# Altium schematic sheet Fri3D_2018_LEDS_00.SchDoc: Fri3D Badge 2018
size A3; Date: 22/05/2017; DrawnBy: Wim Van Gool; DocumentNumber: 3; Revision: 00; SheetNumber: 3; SheetTotal: 4
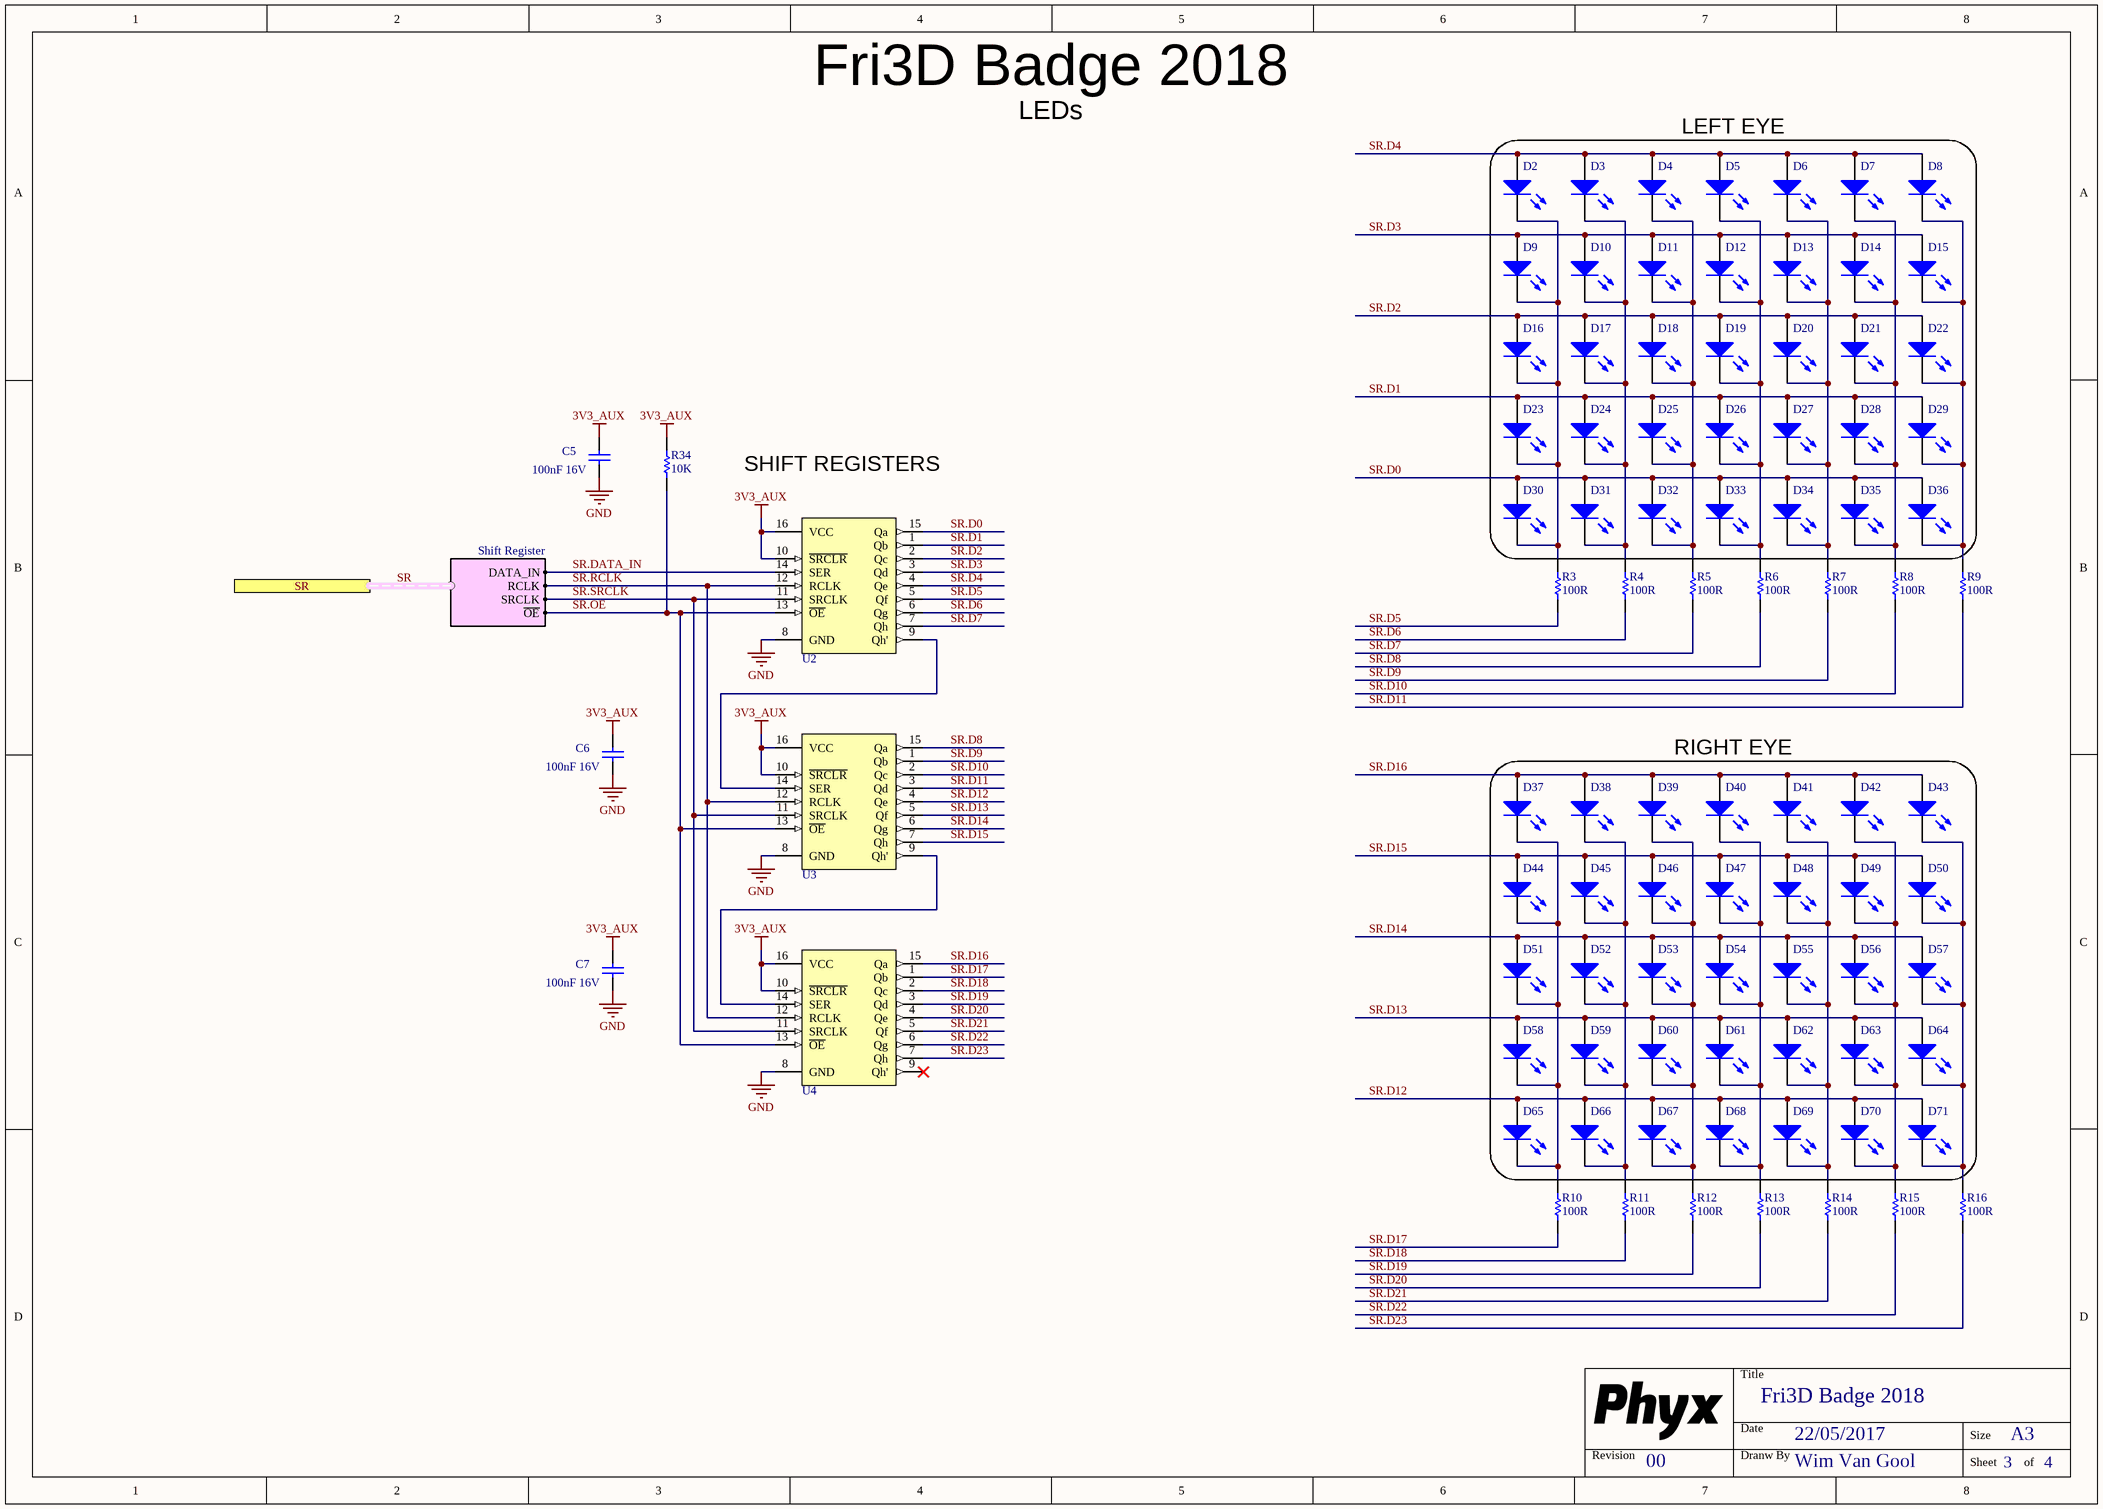
[diagram p0: Fri3D_2018_LEDS_00.SchDoc]

## Parts
C5  value 100nF 16V  [C0603_N]
C6  value 100nF 16V  [C0603_N]
C7  value 100nF 16V  [C0603_N]
D2  Default 0805 Blue LED  [LED_0805_BL]  (value not drawn)
D3  Default 0805 Blue LED  [LED_0805_BL]  (value not drawn)
D4  Default 0805 Blue LED  [LED_0805_BL]  (value not drawn)
D5  Default 0805 Blue LED  [LED_0805_BL]  (value not drawn)
D6  Default 0805 Blue LED  [LED_0805_BL]  (value not drawn)
D7  Default 0805 Blue LED  [LED_0805_BL]  (value not drawn)
D8  Default 0805 Blue LED  [LED_0805_BL]  (value not drawn)
D9  Default 0805 Blue LED  [LED_0805_BL]  (value not drawn)
D10  Default 0805 Blue LED  [LED_0805_BL]  (value not drawn)
D11  Default 0805 Blue LED  [LED_0805_BL]  (value not drawn)
D12  Default 0805 Blue LED  [LED_0805_BL]  (value not drawn)
D13  Default 0805 Blue LED  [LED_0805_BL]  (value not drawn)
D14  Default 0805 Blue LED  [LED_0805_BL]  (value not drawn)
D15  Default 0805 Blue LED  [LED_0805_BL]  (value not drawn)
D16  Default 0805 Blue LED  [LED_0805_BL]  (value not drawn)
D17  Default 0805 Blue LED  [LED_0805_BL]  (value not drawn)
D18  Default 0805 Blue LED  [LED_0805_BL]  (value not drawn)
D19  Default 0805 Blue LED  [LED_0805_BL]  (value not drawn)
D20  Default 0805 Blue LED  [LED_0805_BL]  (value not drawn)
D21  Default 0805 Blue LED  [LED_0805_BL]  (value not drawn)
D22  Default 0805 Blue LED  [LED_0805_BL]  (value not drawn)
D23  Default 0805 Blue LED  [LED_0805_BL]  (value not drawn)
D24  Default 0805 Blue LED  [LED_0805_BL]  (value not drawn)
D25  Default 0805 Blue LED  [LED_0805_BL]  (value not drawn)
D26  Default 0805 Blue LED  [LED_0805_BL]  (value not drawn)
D27  Default 0805 Blue LED  [LED_0805_BL]  (value not drawn)
D28  Default 0805 Blue LED  [LED_0805_BL]  (value not drawn)
D29  Default 0805 Blue LED  [LED_0805_BL]  (value not drawn)
D30  Default 0805 Blue LED  [LED_0805_BL]  (value not drawn)
D31  Default 0805 Blue LED  [LED_0805_BL]  (value not drawn)
D32  Default 0805 Blue LED  [LED_0805_BL]  (value not drawn)
D33  Default 0805 Blue LED  [LED_0805_BL]  (value not drawn)
D34  Default 0805 Blue LED  [LED_0805_BL]  (value not drawn)
D35  Default 0805 Blue LED  [LED_0805_BL]  (value not drawn)
D36  Default 0805 Blue LED  [LED_0805_BL]  (value not drawn)
D37  Default 0805 Blue LED  [LED_0805_BL]  (value not drawn)
D38  Default 0805 Blue LED  [LED_0805_BL]  (value not drawn)
D39  Default 0805 Blue LED  [LED_0805_BL]  (value not drawn)
D40  Default 0805 Blue LED  [LED_0805_BL]  (value not drawn)
D41  Default 0805 Blue LED  [LED_0805_BL]  (value not drawn)
D42  Default 0805 Blue LED  [LED_0805_BL]  (value not drawn)
D43  Default 0805 Blue LED  [LED_0805_BL]  (value not drawn)
D44  Default 0805 Blue LED  [LED_0805_BL]  (value not drawn)
D45  Default 0805 Blue LED  [LED_0805_BL]  (value not drawn)
D46  Default 0805 Blue LED  [LED_0805_BL]  (value not drawn)
D47  Default 0805 Blue LED  [LED_0805_BL]  (value not drawn)
D48  Default 0805 Blue LED  [LED_0805_BL]  (value not drawn)
D49  Default 0805 Blue LED  [LED_0805_BL]  (value not drawn)
D50  Default 0805 Blue LED  [LED_0805_BL]  (value not drawn)
D51  Default 0805 Blue LED  [LED_0805_BL]  (value not drawn)
D52  Default 0805 Blue LED  [LED_0805_BL]  (value not drawn)
D53  Default 0805 Blue LED  [LED_0805_BL]  (value not drawn)
D54  Default 0805 Blue LED  [LED_0805_BL]  (value not drawn)
D55  Default 0805 Blue LED  [LED_0805_BL]  (value not drawn)
D56  Default 0805 Blue LED  [LED_0805_BL]  (value not drawn)
D57  Default 0805 Blue LED  [LED_0805_BL]  (value not drawn)
D58  Default 0805 Blue LED  [LED_0805_BL]  (value not drawn)
D59  Default 0805 Blue LED  [LED_0805_BL]  (value not drawn)
D60  Default 0805 Blue LED  [LED_0805_BL]  (value not drawn)
D61  Default 0805 Blue LED  [LED_0805_BL]  (value not drawn)
D62  Default 0805 Blue LED  [LED_0805_BL]  (value not drawn)
D63  Default 0805 Blue LED  [LED_0805_BL]  (value not drawn)
D64  Default 0805 Blue LED  [LED_0805_BL]  (value not drawn)
D65  Default 0805 Blue LED  [LED_0805_BL]  (value not drawn)
D66  Default 0805 Blue LED  [LED_0805_BL]  (value not drawn)
D67  Default 0805 Blue LED  [LED_0805_BL]  (value not drawn)
D68  Default 0805 Blue LED  [LED_0805_BL]  (value not drawn)
D69  Default 0805 Blue LED  [LED_0805_BL]  (value not drawn)
D70  Default 0805 Blue LED  [LED_0805_BL]  (value not drawn)
D71  Default 0805 Blue LED  [LED_0805_BL]  (value not drawn)
R3  value 100R  [R0603_N]  (hidden comment: RESISTOR)
R4  value 100R  [R0603_N]  (hidden comment: RESISTOR)
R5  value 100R  [R0603_N]  (hidden comment: RESISTOR)
R6  value 100R  [R0603_N]  (hidden comment: RESISTOR)
R7  value 100R  [R0603_N]  (hidden comment: RESISTOR)
R8  value 100R  [R0603_N]  (hidden comment: RESISTOR)
R9  value 100R  [R0603_N]  (hidden comment: RESISTOR)
R10  value 100R  [R0603_N]  (hidden comment: RESISTOR)
R11  value 100R  [R0603_N]  (hidden comment: RESISTOR)
R12  value 100R  [R0603_N]  (hidden comment: RESISTOR)
R13  value 100R  [R0603_N]  (hidden comment: RESISTOR)
R14  value 100R  [R0603_N]  (hidden comment: RESISTOR)
R15  value 100R  [R0603_N]  (hidden comment: RESISTOR)
R16  value 100R  [R0603_N]  (hidden comment: RESISTOR)
R34  value 10K  [R0603_N]  (hidden comment: RESISTOR)
U2  8-Bit Shift Registers With 3-State Output Registers  [SOIC_N_16]  (value not drawn)
U3  8-Bit Shift Registers With 3-State Output Registers  [SOIC_N_16]  (value not drawn)
U4  8-Bit Shift Registers With 3-State Output Registers  [SOIC_N_16]  (value not drawn)

## Blocks framed on the sheet
LEFT EYE: D2-D36
RIGHT EYE: D37-D71

## Ports
SR (harness Shift Register)

## Harnesses
Shift Register: DATA_IN, RCLK, SRCLK, ~{OE}

## Nets
3V3_AUX: C5.1 C6.1 C7.1 R34.1 U2.10(~{SRCLR}) U2.16(VCC) U3.10(~{SRCLR}) U3.16(VCC) U4.10(~{SRCLR}) U4.16(VCC)
GND: C5.2 C6.2 C7.2 U2.8(GND) U3.8(GND) U4.8(GND)
SR.D0: D30.1(A) D31.1(A) D32.1(A) D33.1(A) D34.1(A) D35.1(A) D36.1(A) U2.15(Qa)
SR.D1: D23.1(A) D24.1(A) D25.1(A) D26.1(A) D27.1(A) D28.1(A) D29.1(A) U2.1(Qb)
SR.D2: D16.1(A) D17.1(A) D18.1(A) D19.1(A) D20.1(A) D21.1(A) D22.1(A) U2.2(Qc)
SR.D3: D9.1(A) D10.1(A) D11.1(A) D12.1(A) D13.1(A) D14.1(A) D15.1(A) U2.3(Qd)
SR.D4: D2.1(A) D3.1(A) D4.1(A) D5.1(A) D6.1(A) D7.1(A) D8.1(A) U2.4(Qe)
SR.D5: R3.2 U2.5(Qf)
SR.D6: R4.2 U2.6(Qg)
SR.D7: R5.2 U2.7(Qh)
SR.D8: R6.2 U3.15(Qa)
SR.D9: R7.2 U3.1(Qb)
SR.D10: R8.2 U3.2(Qc)
SR.D11: R9.2 U3.3(Qd)
SR.D12: D65.1(A) D66.1(A) D67.1(A) D68.1(A) D69.1(A) D70.1(A) D71.1(A) U3.4(Qe)
SR.D13: D58.1(A) D59.1(A) D60.1(A) D61.1(A) D62.1(A) D63.1(A) D64.1(A) U3.5(Qf)
SR.D14: D51.1(A) D52.1(A) D53.1(A) D54.1(A) D55.1(A) D56.1(A) D57.1(A) U3.6(Qg)
SR.D15: D44.1(A) D45.1(A) D46.1(A) D47.1(A) D48.1(A) D49.1(A) D50.1(A) U3.7(Qh)
SR.D16: D37.1(A) D38.1(A) D39.1(A) D40.1(A) D41.1(A) D42.1(A) D43.1(A) U4.15(Qa)
SR.D17: R10.2 U4.1(Qb)
SR.D18: R11.2 U4.2(Qc)
SR.D19: R12.2 U4.3(Qd)
SR.D20: R13.2 U4.4(Qe)
SR.D21: R14.2 U4.5(Qf)
SR.D22: R15.2 U4.6(Qg)
SR.D23: R16.2 U4.7(Qh)
SR.DATA_IN: U2.14(SER) ; port SR.DATA_IN
SR.~{OE}: R34.2 U2.13(~{OE}) U3.13(~{OE}) U4.13(~{OE}) ; port SR.~{OE}
SR.RCLK: U2.12(RCLK) U3.12(RCLK) U4.12(RCLK) ; port SR.RCLK
SR.SRCLK: U2.11(SRCLK) U3.11(SRCLK) U4.11(SRCLK) ; port SR.SRCLK
NetD2_2: D2.2(K) D9.2(K) D16.2(K) D23.2(K) D30.2(K) R3.1
NetD3_2: D3.2(K) D10.2(K) D17.2(K) D24.2(K) D31.2(K) R4.1
NetD4_2: D4.2(K) D11.2(K) D18.2(K) D25.2(K) D32.2(K) R5.1
NetD5_2: D5.2(K) D12.2(K) D19.2(K) D26.2(K) D33.2(K) R6.1
NetD6_2: D6.2(K) D13.2(K) D20.2(K) D27.2(K) D34.2(K) R7.1
NetD7_2: D7.2(K) D14.2(K) D21.2(K) D28.2(K) D35.2(K) R8.1
NetD8_2: D8.2(K) D15.2(K) D22.2(K) D29.2(K) D36.2(K) R9.1
NetD37_2: D37.2(K) D44.2(K) D51.2(K) D58.2(K) D65.2(K) R10.1
NetD38_2: D38.2(K) D45.2(K) D52.2(K) D59.2(K) D66.2(K) R11.1
NetD39_2: D39.2(K) D46.2(K) D53.2(K) D60.2(K) D67.2(K) R12.1
NetD40_2: D40.2(K) D47.2(K) D54.2(K) D61.2(K) D68.2(K) R13.1
NetD41_2: D41.2(K) D48.2(K) D55.2(K) D62.2(K) D69.2(K) R14.1
NetD42_2: D42.2(K) D49.2(K) D56.2(K) D63.2(K) D70.2(K) R15.1
NetD43_2: D43.2(K) D50.2(K) D57.2(K) D64.2(K) D71.2(K) R16.1
NetU2_9: U2.9(Qh') U3.14(SER)
NetU3_9: U3.9(Qh') U4.14(SER)

Not connected (* = marked no-connect by the designer): U4 9(Qh')*

## Buses and harness runs
harness SR = port SR

## Notes on the sheet
- Fri3D Badge 2018
- LEDs
- SHIFT REGISTERS
- Title
- Revision
- Date
- Dranw By
- Size
- A3
- Sheet
- of

## Library data of the parts
C5-C7 = CAP # 100nF 16V 0603: Capacitor Ceramic
D2-D71 = LED # Blue 0805: =Description; Supplier 1: Farnell; Supplier Part Number 1: 2217980
R3-R16 = RES # 100R 0603
R34 = RES # 10K 0603: Supplier 1: Farnell; Supplier Part Number 1: 2502397
U2-U4 = IOEXP # SHIFT 74HC595 8-bit: =Description; Value: 74HC595; Supplier 1: Farnell; Supplier Part Number 1: 1278491